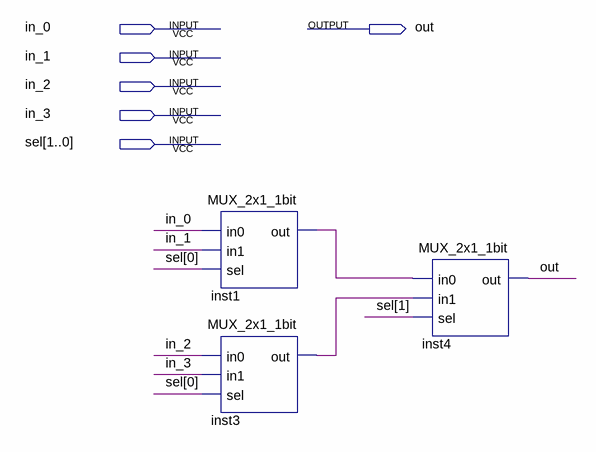
[diagram p0: schematic sheet]
// Quartus schematic MUX_4x2_1bit.bdf as structural Verilog: 3 symbols, 6 pins
module MUX_4x2_1bit (
  input  in_0,
  input  in_1,
  input  in_2,
  input  in_3,
  input  [1:0] sel,
  output out
);

  wire inst1_out, inst3_out;

  MUX_2x1_1bit inst1 (.in0(in_0), .in1(in_1), .sel(sel[0]), .out(inst1_out));
  MUX_2x1_1bit inst3 (.in0(in_2), .in1(in_3), .sel(sel[0]), .out(inst3_out));
  MUX_2x1_1bit inst4 (.in0(inst1_out), .in1(inst3_out), .sel(sel[1]), .out(out));
endmodule
